# Altium schematic sheet USB_OTG_FS.SchDoc: USB_OTG_FS
size A4; Date: 9/24/2014; Author: P.A.; CompanyName: STMicroelectronics; Organization: Microcontrollers Division; Address1: 12, Rue Jules HOROWITZ; Address2: 38019 Grenoble; Address3: FRANCE; DocumentNumber: MB1189; Revision: B-07; SheetNumber: 10; SheetTotal: 12; Project: STM32F469I-DISCO
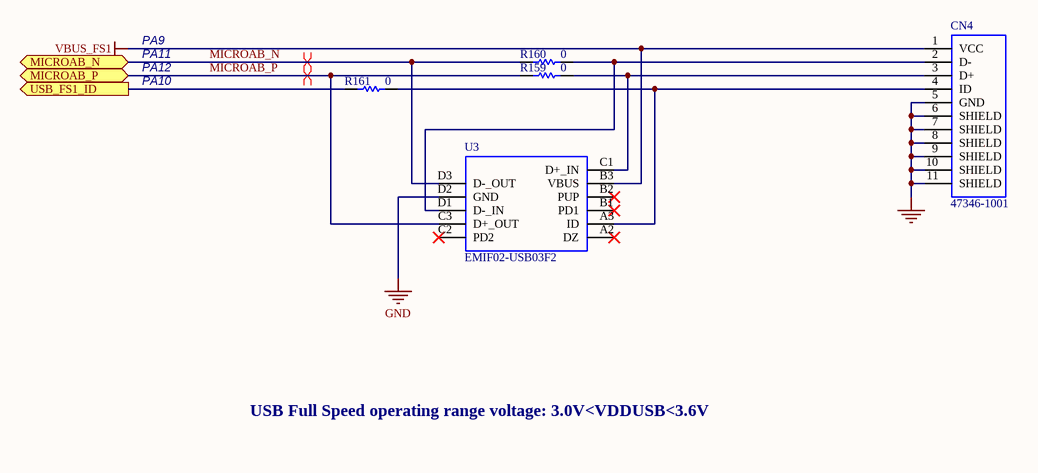
[diagram p0: USB_OTG_FS.SchDoc]

## Parts
CN4  47346-1001  [47346-0001]
R159  0  [RES - 0402]
R160  0  [RES - 0402]
R161  0  [RES - 0402]
U3  EMIF02-USB03F2  [BGA11C50P3X4_144X194X72]

## Ports
MICROAB_N (bidir), MICROAB_P (bidir), USB_FS1_ID (out)

## Nets
GND: CN4.5(GND) CN4.6(SHIELD) CN4.7(SHIELD) CN4.8(SHIELD) CN4.9(SHIELD) CN4.10(SHIELD) CN4.11(SHIELD) U3.D2(GND)
VBUS_FS1: CN4.1(VCC) U3.B3(VBUS)
MICROAB_N: R160.2 U3.D3(D-_OUT) ; port MICROAB_N
MICROAB_P: R159.2 U3.C3(D+_OUT) ; port MICROAB_P
USB_FS1_ID: R161.2 ; port USB_FS1_ID
NetCN4_2: CN4.2(D-) R160.1 U3.D1(D-_IN)
NetCN4_3: CN4.3(D+) R159.1 U3.C1(D+_IN)
NetCN4_4: CN4.4(ID) R161.1 U3.A3(ID)

Not connected (* = marked no-connect by the designer): U3 A2(DZ)* B1(PD1)* B2(PUP)* C2(PD2)*

## Layout directives
differential pair: MICROAB_N, MICROAB_P

## Notes on the sheet
- PA9
- PA10
- PA11
- PA12
- USB Full Speed operating range voltage: 3.0V<VDDUSB<3.6V
- Title:
- Project:
- Size:
- Date:
- A4
- Reference:
- Sheet:
- Revision:
- of

## Library data of the parts
CN4 = 47346-1001: MOLEX - 47346-1001 - MULTIPOLE CONNECTOR; Manufacturer_Name: Molex; Manufacturer_Part_Number: 47346-1001; RS Part Number: *; RS Price/Stock: *; Mouser Part Number: 538-47346-1001; Mouser Price/Stock: https://www.mouser.com/Search/Refine.aspx?Keyword=538-47346-1001; Datasheet Link: http://www.molex.com/webdocs/datasheets/pdf/en-us/0473461001_IO_CONNECTORS.pdf
R159-R161 = Res1: Resistor; Value: 1K; Ordered by: Subcon; Published: 8-Jun-2000; Revision: July-2002: Re-released for DXP Platform.; Publisher: Altium Limited
U3 = EMIF02-USB03F2: New STMicroelectronics EMIF02-USB03F2 EMI Filter & ESD Protector; Geometry.Height: 0.715mm; Manufacturer_Name: STMicroelectronics; Manufacturer_Part_Number: EMIF02-USB03F2; RS Part Number: 1658173; RS Price/Stock: http://uk.rs-online.com/web/p/products/1658173; Arrow Part Number: EMIF02-USB03F2; Arrow Price/Stock: https://www.arrow.com/en/products/emif02-usb03f2/stmicroelectronics; Datasheet Link: http://www.st.com/content/ccc/resource/technical/document/datasheet/0a/25/37/a6/28/ab/4f/24/CD00042880.pdf/files/CD00042880.pdf/jcr:content/translations/en.CD00042880.pdf